# Altium schematic sheet ESP32_PCB.SchDoc
size A
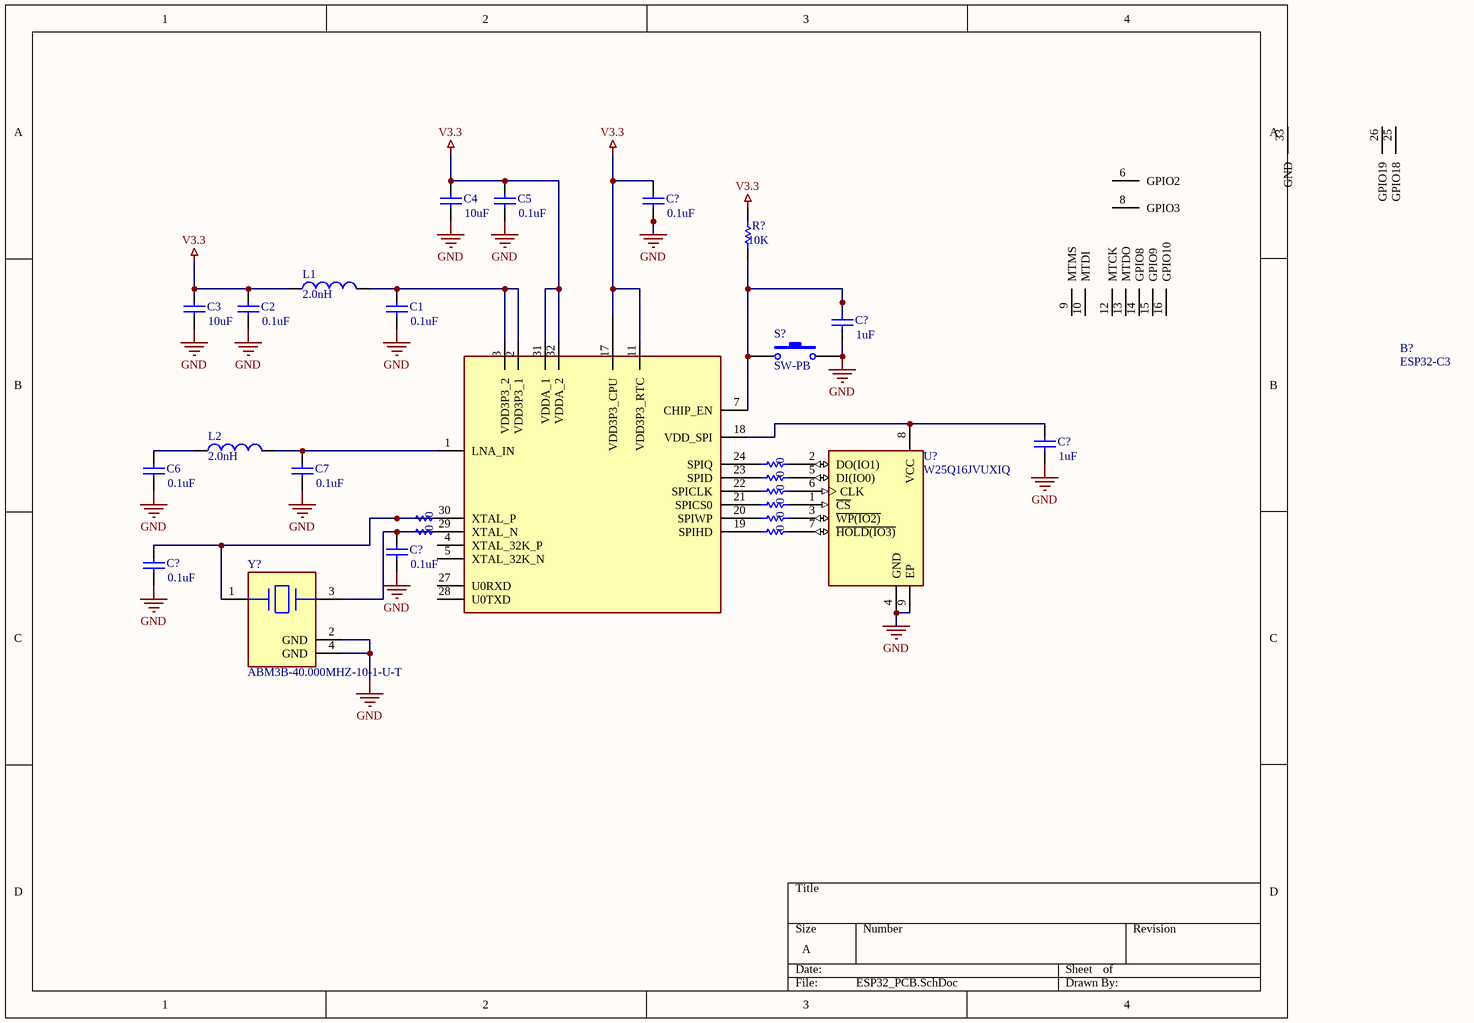
[diagram p0: ESP32_PCB.SchDoc]

## Parts
(Parts that share a designator on the sheet are numbered #1, #2 ... from top to bottom, then left to right.)
B?  ESP32-C3  [QFN50P500X500X90-33N-D]
C1  C1: 0.1uF  [RAD-0.3]
C2  C1: 0.1uF  [RAD-0.3]
C3  C1: 10uF  [RAD-0.3]
C4  C1: 10uF  [RAD-0.3]
C5  C1: 0.1uF  [RAD-0.3]
C6  C1: 0.1uF  [RAD-0.3]
C7  C1: 0.1uF  [RAD-0.3]
C?#1  C1: 0.1uF  [RAD-0.3]
C?#2  C1: 1uF  [RAD-0.3]
C?#3  C1: 1uF  [RAD-0.3]
C?#4  C1: 0.1uF  [RAD-0.3]
C?#5  C1: 0.1uF  [RAD-0.3]
L1  value 2.0nH  [0402-A]
L2  value 2.0nH  [0402-A]
R?#1  value 10K  [AXIAL-0.3]
R?#2  value 0  [AXIAL-0.3]
R?#3  value 0  [AXIAL-0.3]
R?#4  value 0  [AXIAL-0.3]
R?#5  value 0  [AXIAL-0.3]
R?#6  value 0  [AXIAL-0.3]
R?#7  value 0  [AXIAL-0.3]
R?#8  value 0  [AXIAL-0.3]
R?#9  value 0  [AXIAL-0.3]
S?  SW-PB  [SPST-2]
U?  W25Q16JVUXIQ  [FP-UX-MFG]
Y?  ABM3B-40.000MHZ-10-1-U-T  [FP-ABM3B-MFG]

## Nets
GND: C1.1 C2.1 C3.1 C4.1 C5.1 C6.1 C7.1 C?#1.1 C?#2.1 C?#3.1 C?#4.1 C?#5.1 S?.2 U?.4(GND) U?.9(EP) Y?.2(GND) Y?.4(GND)
V3.3: B?.11(VDD3P3_RTC) B?.17(VDD3P3_CPU) B?.31(VDDA_1) B?.32(VDDA_2) C2.2 C3.2 C4.2 C5.2 C?#1.2 L1.1 R?#1.2
NetB?_1: B?.1(LNA_IN) C7.2 L2.2
NetB?_2: B?.2(VDD3P3_1) B?.3(VDD3P3_2) C1.2 L1.2
NetB?_7: B?.7(CHIP_EN) C?#2.2 R?#1.1 S?.1
NetB?_18: B?.18(VDD_SPI) C?#3.2 U?.8(VCC)
NetB?_19: B?.19(SPIHD) R?#9.2
NetB?_20: B?.20(SPIWP) R?#7.2
NetB?_21: B?.21(SPICS0) R?#5.2
NetB?_22: B?.22(SPICLK) R?#4.2
NetB?_23: B?.23(SPID) R?#3.2
NetB?_24: B?.24(SPIQ) R?#2.2
NetB?_29: B?.29(XTAL_N) C?#4.2 R?#8.2 Y?.3
NetB?_30: B?.30(XTAL_P) C?#5.2 R?#6.2 Y?.1
NetC6_2: C6.2 L2.1
NetR?#2_1: R?#2.1 U?.2(DO(IO1))
NetR?#3_1: R?#3.1 U?.5(DI(IO0))
NetR?#4_1: R?#4.1 U?.6(CLK)
NetR?#5_1: R?#5.1 U?.1(~{CS})
NetR?#7_1: R?#7.1 U?.3(~{WP(IO2)})
NetR?#9_1: R?#9.1 U?.7(~{HOLD(IO3)})

Not connected (* = marked no-connect by the designer): B? 4(XTAL_32K_P) 5(XTAL_32K_N) 6(GPIO2) 8(GPIO3) 9(MTMS) 10(MTDI) 12(MTCK) 13(MTDO) 14(GPIO8) 15(GPIO9) 16(GPIO10) 25(GPIO18) 26(GPIO19) 27(U0RXD) 28(U0TXD) 33(GND); R?#6 1; R?#8 1

## Library data of the parts
B? = ESP32-C3: Ultra-Low-Power SoC with RISC-V Single-Core CPU; Manufacturer_Name: Espressif Systems; Geometry.Height: 0.9mm; Mouser Part Number: 356-ESP32-C3; Mouser Price/Stock: https://www.mouser.co.uk/ProductDetail/Espressif-Systems/ESP32-C3?qs=iLbezkQI%252BsiMXe7tMG%252Bo%2FA%3D%3D; Manufacturer_Part_Number: ESP32-C3; Datasheet Link: https://www.espressif.com/sites/default/files/documentation/esp32-c3_datasheet_en.pdf
C1-C7 C?#1-C?#5 = Cap: Capacitor; Published: 8-Jun-2000; LatestRevisionDate: 17-Jul-2002; LatestRevisionNote: Re-released for DXP Platform.; PackageReference: RAD-0.3; Publisher: Altium Limited; PackageDescription: Radial Cap, Thru-Hole; 2 Leads; 0.3 in Pin Spacing
L1 L2 = Inductor: Code_IEC: 1005; Published: 8-Jun-2000; LatestRevisionDate: 29-May-2009; LatestRevisionNote: IPC-7351 Footprint Added.; PackageReference: 0402-A; Publisher: Altium Limited; PackageDescription: Chip Inductor; Code_JEITA: 0402
R?#1-R?#9 = Res1: Resistor; Published: 8-Jun-2000; LatestRevisionDate: 17-Jul-2002; LatestRevisionNote: Re-released for DXP Platform.; PackageReference: AXIAL-0.3; Publisher: Altium Limited; PackageDescription: Axial Device, Thru-Hole; 2 Leads; 0.3 in Pin Spacing
S? = SW-PB: Switch; Published: 24-Mar-1999; LatestRevisionDate: 17-Jul-2002; LatestRevisionNote: Re-released for DXP Platform.; PackageReference: SPST-2; Publisher: Altium Limited; PackageDescription: Switch; 2 Leads
U? = CMP-78876-000011-1: IC FLASH 16MBIT SPI/QUAD 8USON; RoHS Compliant: Yes
Y? = CMP-27762-006129-1: Crystal 40MHz ±10ppm 10pF SMD-4 5mm x 3.2mm; ESR (Equivalent Series Resistance): 50R; Number of Pins: 4; Min Operating Temperature: -10°C; Frequency: 40MHz; Resistor Type: Ceramic; RoHS Compliant: Yes; Frequency Stability: 10ppm; Termination: SMD/SMT; Max Operating Temperature: 60°C; Lead Free: Lead Free; Frequency Tolerance: 10ppm; Radiation Hardening: No; Packaging: Tape and Reel; Mount: Surface Mount; Series: ABM3B; Height: 0.043inch; Width: 3.2mm; Load Capacitance: 10pF; Length: 0.197inch; Package Quantity: 1000; Tolerance: 10ppm; Case/Package: SMD/SMT